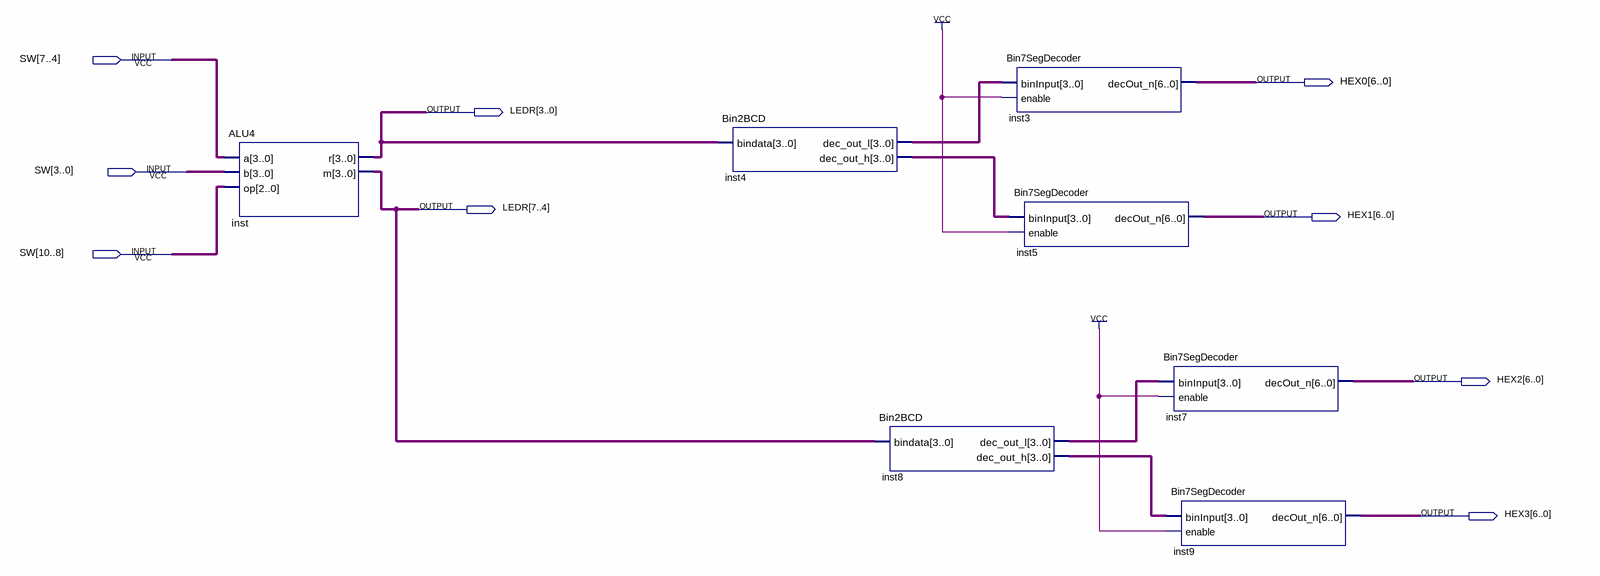
[diagram p0: schematic sheet]
// Quartus schematic ALUDemo.bdf as structural Verilog: 7 symbols, 9 pins
module ALUDemo (
  input  [10:0] SW,
  output [6:0] HEX0,
  output [7:0] LEDR,
  output [6:0] HEX1,
  output [6:0] HEX2,
  output [6:0] HEX3
);

  wire [3:0] inst4_dec_out_h, inst4_dec_out_l, inst8_dec_out_h, inst8_dec_out_l;

  ALU4 inst (.a(SW[7:4]), .b(SW[3:0]), .op(SW[10:8]), .r(LEDR[3:0]), .m(LEDR[7:4]));
  Bin2BCD inst4 (.bindata(LEDR[3:0]), .dec_out_l(inst4_dec_out_l), .dec_out_h(inst4_dec_out_h));
  Bin2BCD inst8 (.bindata(LEDR[7:4]), .dec_out_l(inst8_dec_out_l), .dec_out_h(inst8_dec_out_h));
  Bin7SegDecoder inst3 (.binInput(inst4_dec_out_l), .enable(1'b1), .decOut_n(HEX0));
  Bin7SegDecoder inst5 (.binInput(inst4_dec_out_h), .enable(1'b1), .decOut_n(HEX1));
  Bin7SegDecoder inst7 (.binInput(inst8_dec_out_l), .enable(1'b1), .decOut_n(HEX2));
  Bin7SegDecoder inst9 (.binInput(inst8_dec_out_h), .enable(1'b1), .decOut_n(HEX3));
endmodule
